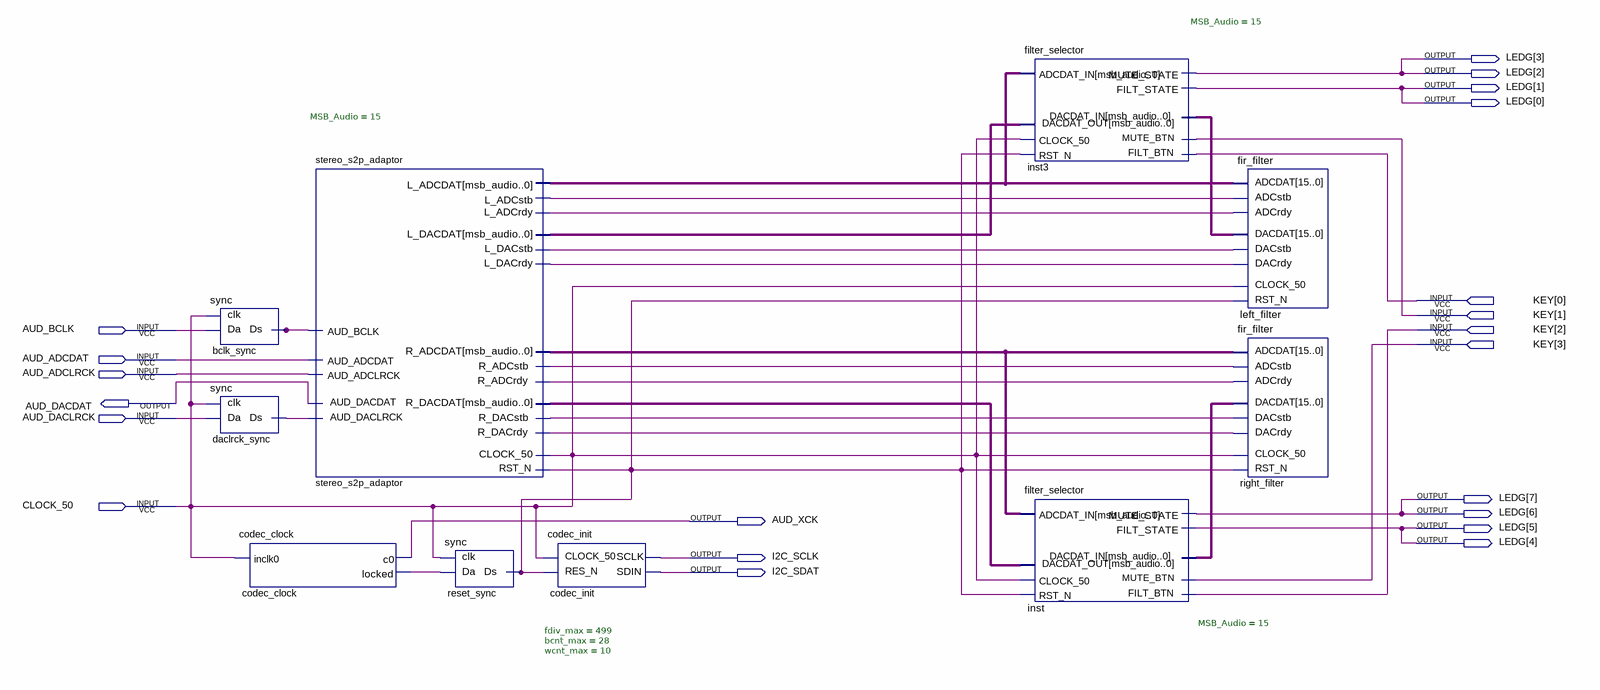
[diagram p0: schematic sheet]
// Quartus schematic coursework.bdf as structural Verilog: 10 symbols, 21 pins
module coursework (
  input  [3:0] KEY,
  input  AUD_BCLK,
  input  AUD_ADCDAT,
  input  AUD_ADCLRCK,
  input  AUD_DACLRCK,
  input  CLOCK_50,
  output [7:0] LEDG,
  output AUD_DACDAT,
  output AUD_XCK,
  output I2C_SCLK,
  output I2C_SDAT
);

  wire bclk_sync_ds, codec_clock_locked, daclrck_sync_ds, left_filter_adcrdy, left_filter_dacstb,
       reset_sync_ds, right_filter_adcrdy, right_filter_dacstb, stereo_s2p_adaptor_l_adcstb,
       stereo_s2p_adaptor_l_dacrdy, stereo_s2p_adaptor_r_adcstb, stereo_s2p_adaptor_r_dacrdy;
  wire [15:0] inst3_dacdat_out, inst_dacdat_out, left_filter_dacdat, right_filter_dacdat,
       stereo_s2p_adaptor_l_adcdat, stereo_s2p_adaptor_r_adcdat;

  sync bclk_sync (.clk(CLOCK_50), .Da(AUD_BCLK), .Ds(bclk_sync_ds));
  sync daclrck_sync (.clk(CLOCK_50), .Da(AUD_DACLRCK), .Ds(daclrck_sync_ds));
  codec_clock codec_clock (.inclk0(CLOCK_50), .c0(AUD_XCK), .locked(codec_clock_locked));
  stereo_s2p_adaptor #(.MSB_Audio(15)) stereo_s2p_adaptor (
    .L_DACDAT(inst3_dacdat_out), .L_ADCrdy(left_filter_adcrdy), .L_DACstb(left_filter_dacstb),
    .R_DACDAT(inst_dacdat_out), .R_ADCrdy(right_filter_adcrdy), .R_DACstb(right_filter_dacstb),
    .AUD_ADCDAT(AUD_ADCDAT), .AUD_ADCLRCK(AUD_ADCLRCK), .AUD_DACLRCK(daclrck_sync_ds),
    .AUD_BCLK(bclk_sync_ds), .CLOCK_50(CLOCK_50), .RST_N(reset_sync_ds),
    .L_ADCDAT(stereo_s2p_adaptor_l_adcdat), .L_DACrdy(stereo_s2p_adaptor_l_dacrdy),
    .L_ADCstb(stereo_s2p_adaptor_l_adcstb), .R_ADCDAT(stereo_s2p_adaptor_r_adcdat),
    .R_DACrdy(stereo_s2p_adaptor_r_dacrdy), .R_ADCstb(stereo_s2p_adaptor_r_adcstb), .AUD_DACDAT(AUD_DACDAT));
  sync reset_sync (.clk(CLOCK_50), .Da(codec_clock_locked), .Ds(reset_sync_ds));
  codec_init #(.fdiv_max(499), .bcnt_max(28), .wcnt_max(10)) codec_init (
    .CLOCK_50(CLOCK_50), .RES_N(reset_sync_ds), .SCLK(I2C_SCLK), .SDIN(I2C_SDAT));
  filter_selector #(.MSB_Audio(15)) inst3 (
    .MUTE_BTN(KEY[1]), .FILT_BTN(KEY[0]), .ADCDAT_IN(stereo_s2p_adaptor_l_adcdat),
    .DACDAT_IN(left_filter_dacdat), .CLOCK_50(CLOCK_50), .RST_N(reset_sync_ds), .MUTE_STATE(LEDG[3]),
    .FILT_STATE(LEDG[1]), .DACDAT_OUT(inst3_dacdat_out));
  filter_selector #(.MSB_Audio(15)) inst (
    .MUTE_BTN(KEY[3]), .FILT_BTN(KEY[2]), .ADCDAT_IN(stereo_s2p_adaptor_r_adcdat),
    .DACDAT_IN(right_filter_dacdat), .CLOCK_50(CLOCK_50), .RST_N(reset_sync_ds), .MUTE_STATE(LEDG[7]),
    .FILT_STATE(LEDG[5]), .DACDAT_OUT(inst_dacdat_out));
  fir_filter left_filter (
    .ADCDAT(stereo_s2p_adaptor_l_adcdat), .DACrdy(stereo_s2p_adaptor_l_dacrdy),
    .ADCstb(stereo_s2p_adaptor_l_adcstb), .CLOCK_50(CLOCK_50), .RST_N(reset_sync_ds),
    .DACDAT(left_filter_dacdat), .ADCrdy(left_filter_adcrdy), .DACstb(left_filter_dacstb));
  fir_filter right_filter (
    .ADCDAT(stereo_s2p_adaptor_r_adcdat), .DACrdy(stereo_s2p_adaptor_r_dacrdy),
    .ADCstb(stereo_s2p_adaptor_r_adcstb), .CLOCK_50(CLOCK_50), .RST_N(reset_sync_ds),
    .DACDAT(right_filter_dacdat), .ADCrdy(right_filter_adcrdy), .DACstb(right_filter_dacstb));

  assign {LEDG[6], LEDG[4], LEDG[2], LEDG[0]} = {LEDG[7], LEDG[5], LEDG[3], LEDG[1]};
endmodule
